# EAGLE schematic polarityswitch (EAGLE 4.13)
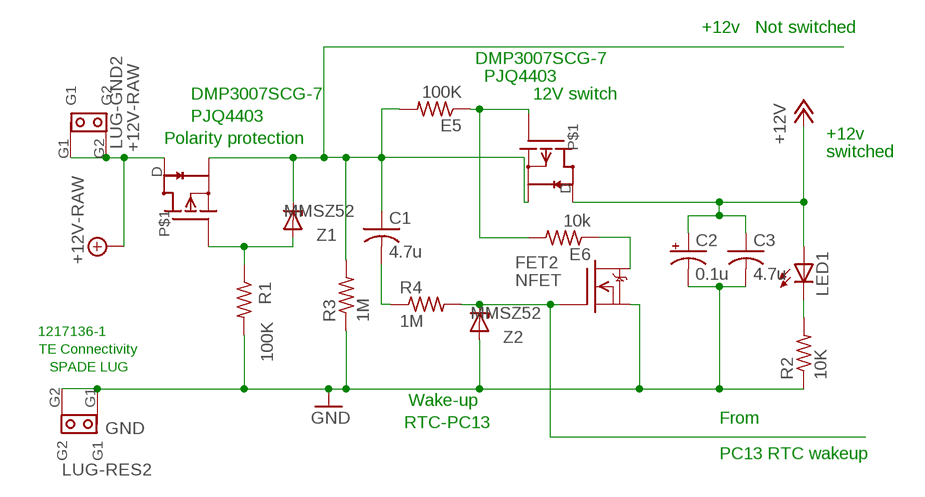
[diagram p0: schematic, sheet 1]

## Parts
C1  4.7u  C-USC0805  [C0805]
C2  0.1u  CPOL-USE5-8.5  [E5-8,5]
C3  4.7u  C-USC0805  [C0805]
E5  100K  R-US_R0603  [R0603]
E6  10k  R-US_R0603  [R0603]
FET1  PJQ4403P  [DFN3333-8L]
FET2  NFET  DMN3404L  [SOT-23]
LED1  LEDCHIP-LED0603  [CHIP-LED0603]
LUG-GND2  +12V-RAW  SPADE-TAB  [SPADE_TAB]
LUG-RES2  GND  SPADE-TAB  [SPADE_TAB]
R1  100K  R-US_R0603  [R0603]
R2  10K  R-US_R0603  [R0603]
R3  1M  R-US_R0603  [R0603]
R4  1M  R-US_R0603  [R0603]
U$3  PJQ4403P  [DFN3333-8L]
Z1  MMSZ52  ZENER-DIODESOD80C  [SOD80C]
Z2  MMSZ52  ZENER-DIODESOD80C  [SOD80C]

## Nets
+12V: C2.+ C3.1 LED1.A U$3.D
+12V-PROTECTED: C1.1 E5.2 FET1.S(S3) R3.2 U$3.S(S3) Z1.C
+12V-RAW: FET1.D LUG-GND2.G1 LUG-GND2.G2
FET103-GATE: FET1.G R1.1 Z1.A
GND: C2.- C3.2 FET2.2(S) LUG-RES2.G1 LUG-RES2.G2 R1.2 R2.1 R3.1 Z2.A
LED_BUS_PWR: LED1.C R2.2
N$5: C1.2 R4.1
N$21: E5.1 E6.2 U$3.G
PC13: FET2.1(G) R4.2 Z2.C
POLARITY-TURN0N-DRAIN: E6.1 FET2.3(D)

## Notes on the sheet
- +12v | Not switched
- DMP3007SCG-7
- PJQ4403
- DMP3007SCG-7 | 12V switch
- PJQ4403
- Polarity protection | +12v
- switched
- 1217136-1
- TE Connectivity
- SPADE LUG
- Wake-up
- RTC-PC13 | From
- PC13 RTC wakeup

## Library data of the parts
C1 C3 = rcl:C-US: CAPACITOR, American symbol
C2 = rcl:CPOL-US: POLARIZED CAPACITOR, American symbol
E5 E6 R1-R4 = rcl:R-US_: RESISTOR, American symbol
FET1 U$3 = transistor-fet:PJQ4403P
FET2 = transistor-fet:DMN3404L
LED1 = led:LED: LED OSRAM: - CHIPLED LG R971, LG N971, LY N971, LG Q971, LY Q971, LO R971, LY R971 LH N974, LH R974 LS Q976, LO Q976, LY Q976 LO Q996 - Hyper CHIPLED LW Q18S LB Q993, LB Q99A, LB R99A - SideLED LS A670, LO A670, LY A670, LG A670, LP A670 LB A673, LV A673, LT A673, LW A673 LH A674 LY A675 LS A676, LA A676, LO A676, LY A676, LW A676 LS A679, LY A679, LG A679 - Hyper Micro SIDELED® LS Y876, LA Y876, LO Y876, LY Y876 LT Y87S - SmartLED LW L88C, LW L88S LB L89C, LB L89S, LG L890 LS L89K, LO L89K, LY L89K LS L896, LA L896, LO L896, LY L896 - TOPLED LS T670, LO T670, LY T670, LG T670, LP T670 LSG T670, LSP T670, LSY T670, LOP T670, LYG T670 LG T671, LOG T671, LSG T671 LB T673, LV T673, LT T673, LW T673 LH T674 LS T676, LA T676, LO T676, LY T676, LB T676, LH T676, LSB T676, LW T676 LB T67C, LV T67C, LT T67C, LS T67K, LO T67K, LY T67K, LW E67C LS E67B, LA E67B, LO E67B, LY E67B, LB E67C, LV E67C, LT E67C LW T67C LS T679, LY T679, LG T679 LS T770, LO T770, LY T770, LG T770, LP T770 LB T773, LV T773, LT T773, LW T773 LH T774 LS E675, LA E675, LY E675, LS T675 LS T776, LA T776, LO T776, LY T776, LB T776 LHGB T686 LT T68C, LB T68C - Hyper Mini TOPLED® LB M676 - Mini TOPLED Santana® LG M470 LS M47K, LO M47K, LY M47K Source: http://www.osram.convergy.de/
LUG-GND2 LUG-RES2 = DEH:SPADE-TAB
Z1 Z2 = diode-1:ZENER-DIODE: Z-Diode